# Altium schematic sheet Filter Capacitors - Port F.SchDoc: PORT F Filter Capacitors
size A4; DocumentNumber: 40; SheetNumber: 40; SheetTotal: 54
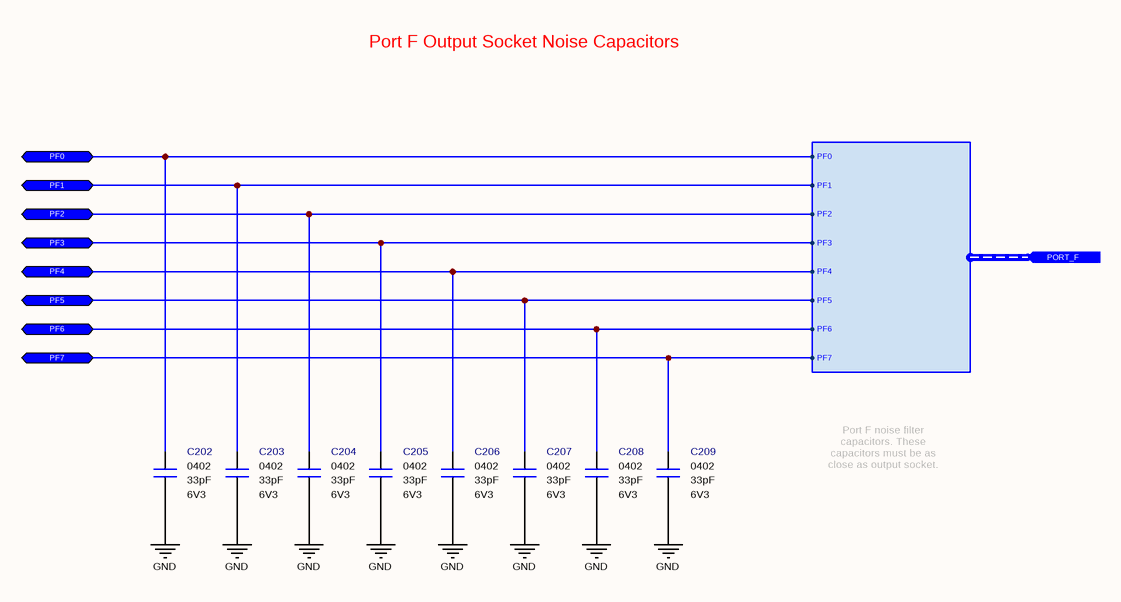
[diagram p0: Filter Capacitors - Port F.SchDoc]

## Parts
C202  value 33pF  Case: 0402  Voltage: 6V3  [CAPACITOR_0402]  (hidden comment: Multilayer Ceramic Capacitor)
C203  value 33pF  Case: 0402  Voltage: 6V3  [CAPACITOR_0402]  (hidden comment: Multilayer Ceramic Capacitor)
C204  value 33pF  Case: 0402  Voltage: 6V3  [CAPACITOR_0402]  (hidden comment: Multilayer Ceramic Capacitor)
C205  value 33pF  Case: 0402  Voltage: 6V3  [CAPACITOR_0402]  (hidden comment: Multilayer Ceramic Capacitor)
C206  value 33pF  Case: 0402  Voltage: 6V3  [CAPACITOR_0402]  (hidden comment: Multilayer Ceramic Capacitor)
C207  value 33pF  Case: 0402  Voltage: 6V3  [CAPACITOR_0402]  (hidden comment: Multilayer Ceramic Capacitor)
C208  value 33pF  Case: 0402  Voltage: 6V3  [CAPACITOR_0402]  (hidden comment: Multilayer Ceramic Capacitor)
C209  value 33pF  Case: 0402  Voltage: 6V3  [CAPACITOR_0402]  (hidden comment: Multilayer Ceramic Capacitor)

## Ports
PF0 (bidir), PF1 (bidir), PF2 (bidir), PF3 (bidir), PF4 (bidir), PF5 (bidir), PF6 (bidir), PF7 (bidir), PORT_F (in, harness PORT_F)

## Harnesses
PORT_F: PF0, PF1, PF2, PF3, PF4, PF5, PF7, PF6

## Nets
GND: C202.1 C203.1 C204.1 C205.1 C206.1 C207.1 C208.1 C209.1
PF0: C202.2 ; port PF0, port PORT_F.PF0
PF1: C203.2 ; port PF1, port PORT_F.PF1
PF2: C204.2 ; port PF2, port PORT_F.PF2
PF3: C205.2 ; port PF3, port PORT_F.PF3
PF4: C206.2 ; port PF4, port PORT_F.PF4
PF5: C207.2 ; port PF5, port PORT_F.PF5
PF6: C208.2 ; port PF6, port PORT_F.PF6
PF7: C209.2 ; port PF7, port PORT_F.PF7

## Notes on the sheet
- Port F Output Socket Noise Capacitors
- Port F noise filter capacitors. These capacitors must be as close as output socket.
- Title
- Size:
- Date:
- A4
- Number:
- Time:
- Revision:
- Sheet
- of
- File:

## Library data of the parts
C202-C209 = Capacitor - 33pF [0402-6V3]: Capacitor - 33pF [0402] (Ceramic); Manufacturer Name: Kemet; Manufacturer Part Number: C0402C330J9RACAUTO; Dielectric: X7R; Tolerance: 10%; Height: 0.5mm; Maximum Operating Temperature: +125; Minimum Operating Temperature: -55; ROHS: Yes; ComponentLink1Description: DataSheet; ComponentLink1URL: https://api.kemet.com/component-edge/download/datasheet/C0402C330J9RACAUTO.pdf; ComponentLink2Description: Mouser; ComponentLink2URL: https://www.mouser.com/Search/Refine.aspx?Keyword=80-C0402C330J9RAUTO; Supplier 1: Mouser; Supplier Part Number 1: 80-C0402C330J9RAUTO; Mouser Part Number: 80-C0402C330J9RAUTO